# EAGLE schematic Fulmar_v_1_1_0 (EAGLE 8.3.2)

## Sheet 1 of 3
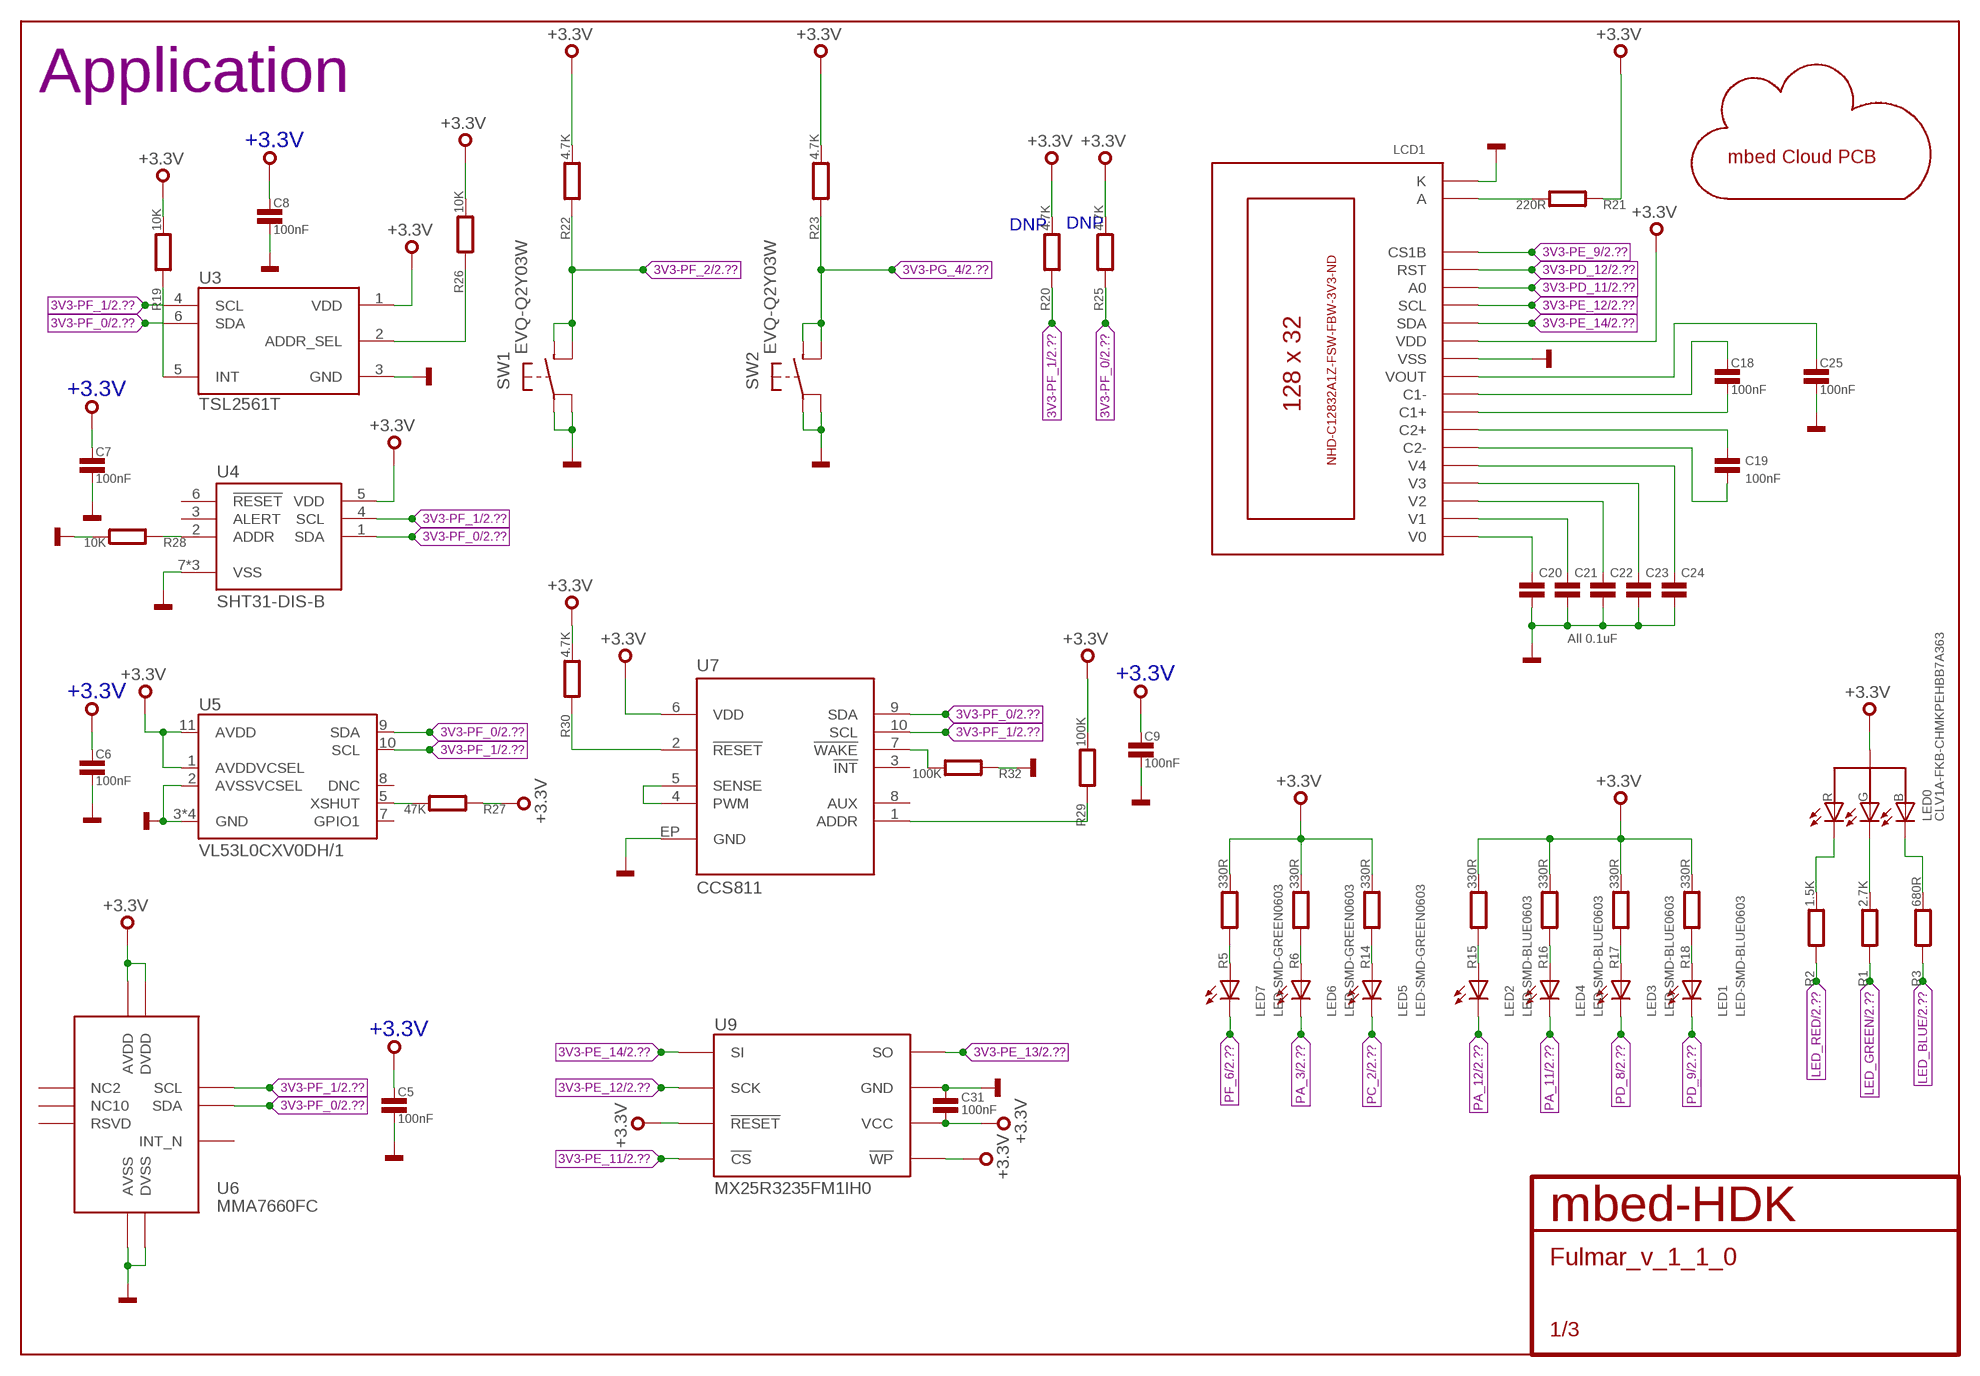
[diagram p0: schematic, sheet 1]

### Parts
C5  100nF  CAPACITOR0603  [0603]
C6  100nF  CAPACITOR0603  [0603]
C7  100nF  CAPACITOR0603  [0603]
C8  100nF  CAPACITOR0603  [0603]
C9  100nF  CAPACITOR0603  [0603]
C18  100nF  CAPACITOR0402  [0402]
C19  100nF  CAPACITOR0402  [0402]
C20  100nF  CAPACITOR0402  [0402]
C21  100nF  CAPACITOR0402  [0402]
C22  100nF  CAPACITOR0402  [0402]
C23  100nF  CAPACITOR0402  [0402]
C24  100nF  CAPACITOR0402  [0402]
C25  100nF  CAPACITOR0402  [0402]
C31  100nF  CAPACITOR0603  [0603]
LCD1  C12832A1Z  [C12832A1Z]
LED0  CLV1A-FKB-CHMKPEHBB7A363  [CLV1A-FKB-CHMKPEHBB7A363]
LED1  LED-SMD-BLUE0603  [CHIPLED_0603]
LED2  LED-SMD-BLUE0603  [CHIPLED_0603]
LED3  LED-SMD-BLUE0603  [CHIPLED_0603]
LED4  LED-SMD-BLUE0603  [CHIPLED_0603]
LED5  LED-SMD-GREEN0603  [CHIPLED_0603]
LED6  LED-SMD-GREEN0603  [CHIPLED_0603]
LED7  LED-SMD-GREEN0603  [CHIPLED_0603]
R1  2.7K  RESISTOR0402  [0402]
R2  1.5K  RESISTOR0402  [0402]
R3  680R  RESISTOR0402  [0402]
R5  330R  RESISTOR0402  [0402]
R6  330R  RESISTOR0402  [0402]
R14  330R  RESISTOR0402  [0402]
R15  330R  RESISTOR0402  [0402]
R16  330R  RESISTOR0402  [0402]
R17  330R  RESISTOR0402  [0402]
R18  330R  RESISTOR0402  [0402]
R19  10K  RESISTOR0402  [0402]
R20  4.7K  RESISTOR0402  [0402]
R21  220R  RESISTOR0402  [0402]
R22  4.7K  RESISTOR0402  [0402]
R23  4.7K  RESISTOR0402  [0402]
R25  4.7K  RESISTOR0402  [0402]
R26  10K  RESISTOR0402  [0402]
R27  47K  RESISTOR0402  [0402]
R28  10K  RESISTOR0402  [0402]
R29  100K  RESISTOR0402  [0402]
R30  4.7K  RESISTOR0402  [0402]
R32  100K  RESISTOR0402  [0402]
SW1  EVQ-Q2Y03W  [EVQ-Q2Y03W]
SW2  EVQ-Q2Y03W  [EVQ-Q2Y03W]
U3  TSL2561T  [6-TMB]
U4  SHT31-DIS-B  [8-DFN]
U5  VL53L0CXV0DH/1  [VL53L0CXV0DH/1]
U6  MMA7660FC  [DFN10-3X3MM]
U7  CCS811  [LGA10]
U9  MX25R3235FM1IH0  [SO8]
U$2  MBEDCLOUDPCB  [MBEDCLOUDPCB]

### Nets
3V3-PD_11: LCD1.P$15(A0) ; also sheet 2
3V3-PD_12: LCD1.P$16(RST) ; also sheet 2
3V3-PE_9: LCD1.P$17(CS1B) ; also sheet 2
3V3-PE_11: U9.1(!CS) ; also sheet 2
3V3-PE_12: LCD1.P$14(SCL) U9.6(SCK) ; also sheet 2
3V3-PE_13: U9.2(SO) ; also sheet 2
3V3-PE_14: LCD1.P$13(SDA) U9.5(SI) ; also sheet 2
3V3-PF_0: R25.1 U3.6(SDA) U4.1(SDA) U5.9(SDA) U6.P$7(SDA) U7.9(SDA) ; also sheet 2
3V3-PF_1: R20.1 U3.4(SCL) U4.4(SCL) U5.10(SCL) U6.P$6(SCL) U7.10(SCL) ; also sheet 2
3V3-PF_2: R22.1 SW1.P$3(B1) SW1.P$4(B2) ; also sheet 2
3V3-PG_4: R23.1 SW2.P$3(B1) SW2.P$4(B2) ; also sheet 2
+3.3V: C5.1 C6.1 C7.1 C8.1 C9.1 C31.2 LCD1.P$12(VDD) LED0.2 R5.2 R6.2 R14.2 R15.2 R16.2 R17.2 R18.2 R19.2 R20.2 R21.1 R22.2 R23.2 R25.2 R26.2 R27.1 R29.2 R30.2 U3.1(VDD) U4.5(VDD) U5.1(AVDDVCSEL) U5.11(AVDD) U6.P$3(AVDD) U6.P$9(DVDD) U7.6(VDD) U9.3(!WP) U9.7(!RESET) U9.8(VCC) ; also sheet 2,3
GND: C5.2 C6.2 C7.2 C8.2 C9.2 C20.2 C21.2 C22.2 C23.2 C24.2 C25.2 C31.1 LCD1.K LCD1.P$11(VSS) R28.2 R32.1 SW1.P$1(A1) SW1.P$2(A2) SW2.P$1(A1) SW2.P$2(A2) U3.3(GND) U4.7(VSS) U4.8(VSS) U4.9(VSS) U5.2(AVSSVCSEL) U5.3(GND) U5.4(GND) U5.6(GND) U5.12(GND) U6.P$4(AVSS) U6.P$8(DVSS) U7.EP(GND) U9.4(GND) ; also sheet 2,3
LED_BLUE: R3.1 ; also sheet 2
LED_GREEN: R1.1 ; also sheet 2
LED_RED: R2.1 ; also sheet 2
N$1: R27.2 U5.5(XSHUT)
N$2: R30.1 U7.2(!RESET!)
N$3: R28.1 U4.2(ADDR)
N$4: U7.4(PWM) U7.5(SENSE)
N$5: R29.1 U7.1(ADDR)
N$6: R32.2 U7.7(!WAKE!)
N$7: C18.1 LCD1.P$9(C1-)
N$8: C18.2 LCD1.P$8(C1+)
N$9: C19.1 LCD1.P$7(C2+)
N$10: C19.2 LCD1.P$6(C2-)
N$11: C20.1 LCD1.P$1(V0)
N$12: C21.1 LCD1.P$2(V1)
N$13: LCD1.A R21.2
N$14: C22.1 LCD1.P$3(V2)
N$15: C23.1 LCD1.P$4(V3)
N$16: C24.1 LCD1.P$5(V4)
N$17: LED0.1 R2.2
N$18: C25.1 LCD1.P$10(VOUT)
N$19: LED0.4 R1.2
N$20: LED0.3 R3.2
N$21: LED7.A R5.1
N$23: LED6.A R6.1
N$24: R19.1 U3.5(INT)
N$25: LED5.A R14.1
N$26: R26.1 U3.2(ADDR_SEL)
N$28: LED2.A R15.1
N$30: LED4.A R16.1
N$31: LED3.A R17.1
N$32: LED1.A R18.1
PA_3: LED6.C ; also sheet 2
PA_11: LED4.C ; also sheet 2
PA_12: LED2.C ; also sheet 2
PC_2: LED5.C ; also sheet 2
PD_8: LED3.C ; also sheet 2
PD_9: LED1.C ; also sheet 2
PF_6: LED7.C ; also sheet 2
Unconnected: U4.3(ALERT) U4.6(!RESET) U5.7(GPIO1) U5.8(DNC) U6.P$1(RSVD) U6.P$2(NC2) U6.P$5(INT_N) U6.P$10(NC10) U7.3(!INT!) U7.8(AUX)

### Notes on the sheet
- Application
- DNP | DNP
- All 0.1uF

## Sheet 2 of 3
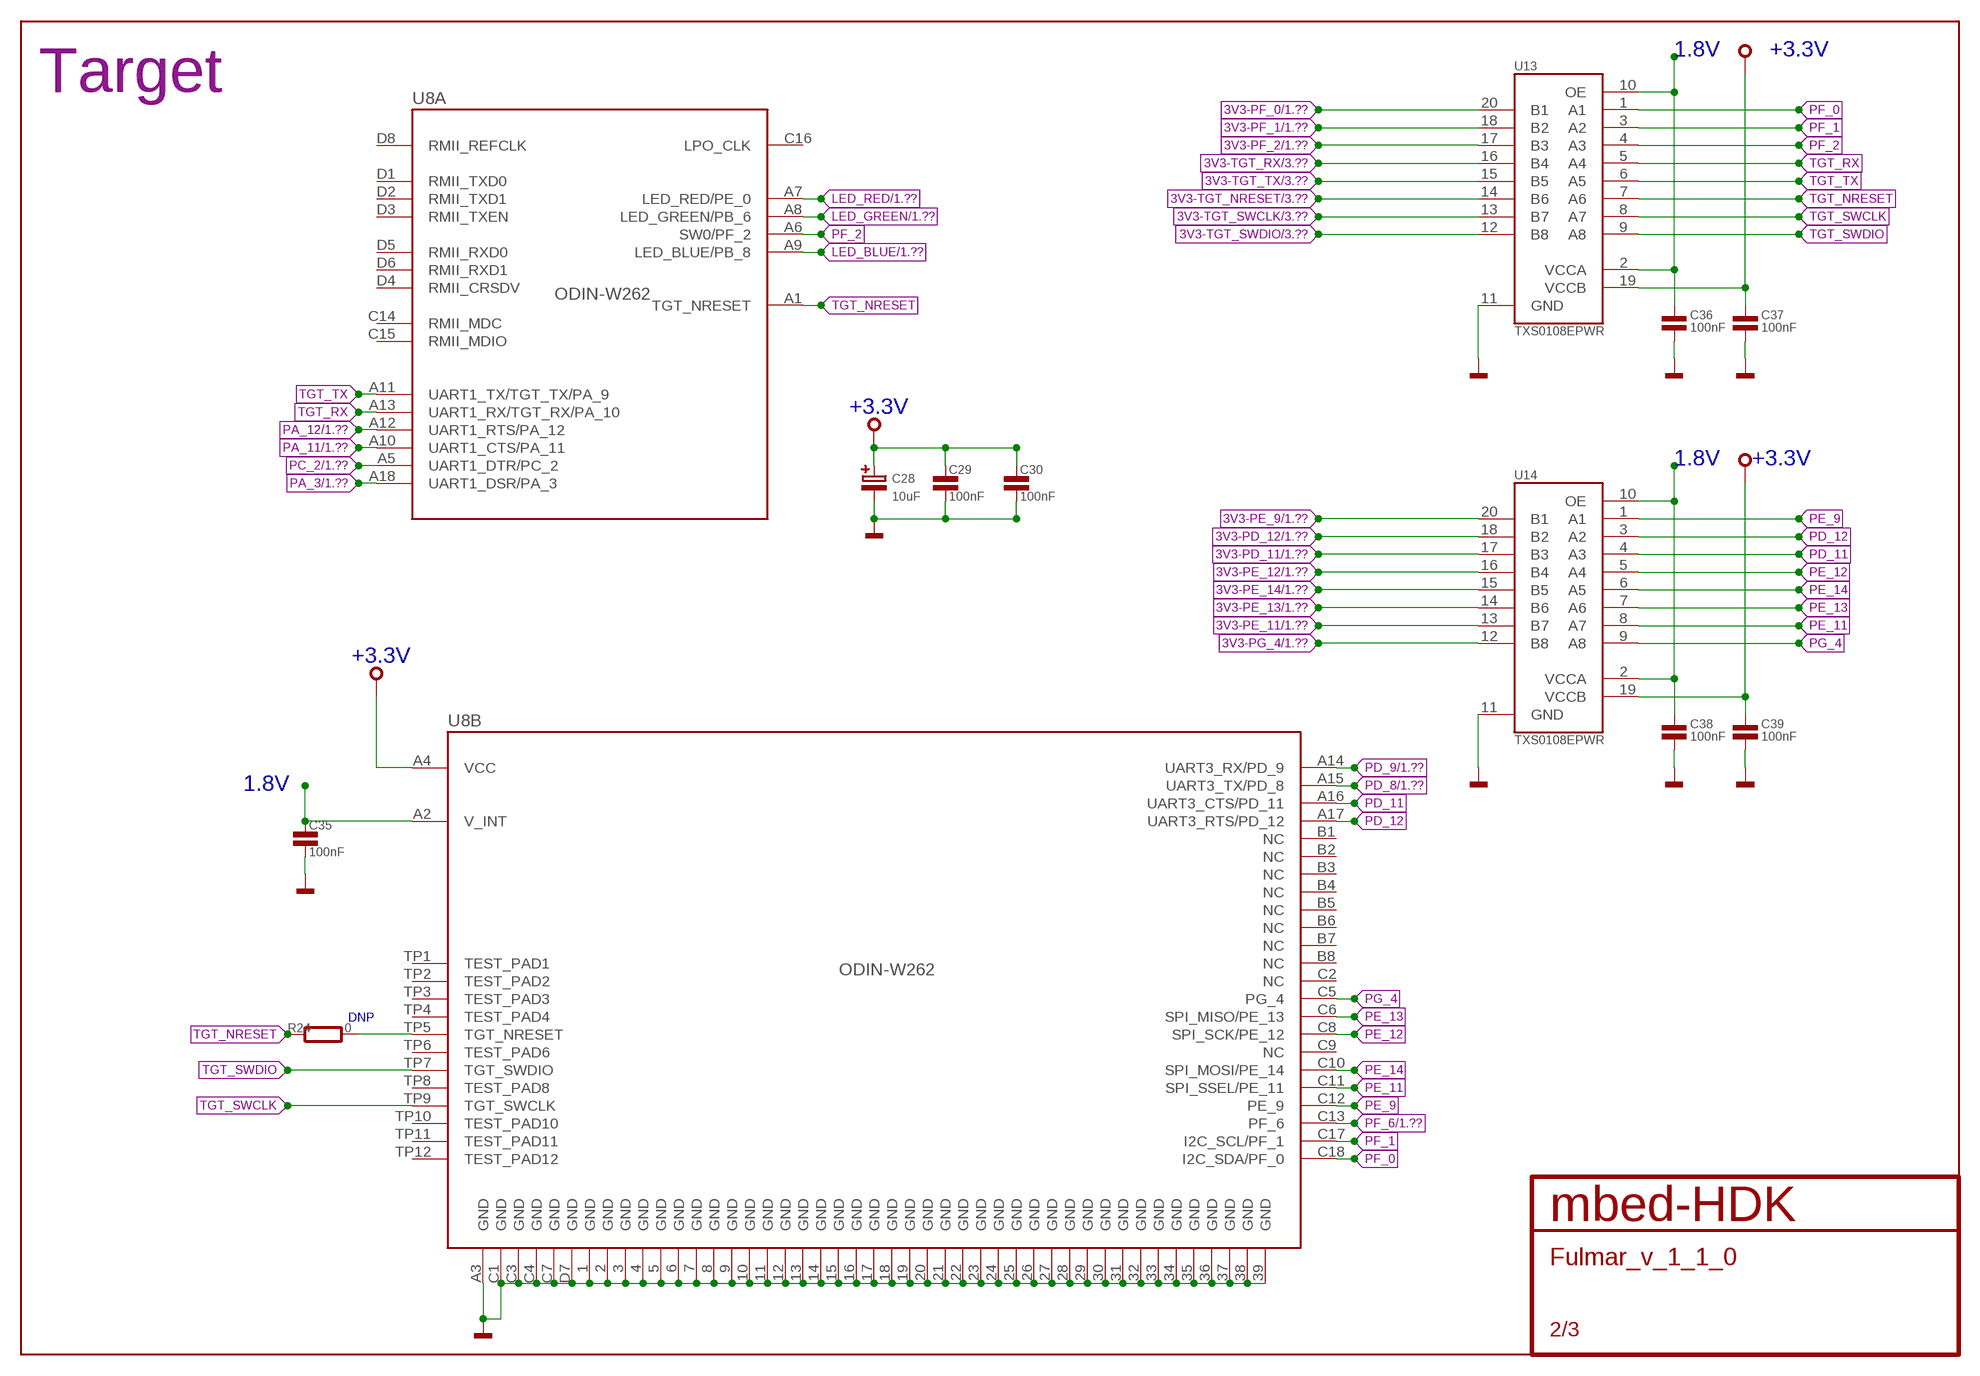
[diagram p1: schematic, sheet 2]

### Parts
C28  10uF  CAPACITOR-POLARISEDB  [SMC_B]
C29  100nF  CAPACITOR0603  [0603]
C30  100nF  CAPACITOR0603  [0603]
C35  100nF  CAPACITOR0603  [0603]
C36  100nF  CAPACITOR0603  [0603]
C37  100nF  CAPACITOR0603  [0603]
C38  100nF  CAPACITOR0603  [0603]
C39  100nF  CAPACITOR0603  [0603]
R24  0  RESISTOR0402  [0402]
U8  ODIN-W262  [ODIN-88]
U13  TXS0108EPWR  [TSSOP-20]
U14  TXS0108EPWR  [TSSOP-20]

### Nets
1.8V: C35.1 C36.1 C38.1 U8.A2(B:V_INT) U13.2(VCCA) U13.10(OE) U14.2(VCCA) U14.10(OE)
3V3-PD_11: U14.17(B3) ; also sheet 1
3V3-PD_12: U14.18(B2) ; also sheet 1
3V3-PE_9: U14.20(B1) ; also sheet 1
3V3-PE_11: U14.13(B7) ; also sheet 1
3V3-PE_12: U14.16(B4) ; also sheet 1
3V3-PE_13: U14.14(B6) ; also sheet 1
3V3-PE_14: U14.15(B5) ; also sheet 1
3V3-PF_0: U13.20(B1) ; also sheet 1
3V3-PF_1: U13.18(B2) ; also sheet 1
3V3-PF_2: U13.17(B3) ; also sheet 1
3V3-PG_4: U14.12(B8) ; also sheet 1
3V3-TGT_NRESET: U13.14(B6) ; also sheet 3
3V3-TGT_RX: U13.16(B4) ; also sheet 3
3V3-TGT_SWCLK: U13.13(B7) ; also sheet 3
3V3-TGT_SWDIO: U13.12(B8) ; also sheet 3
3V3-TGT_TX: U13.15(B5) ; also sheet 3
+3.3V: C28.+ C29.1 C30.1 C37.1 C39.1 U8.A4(B:VCC) U13.19(VCCB) U14.19(VCCB) ; also sheet 1,3
GND: C28.- C29.2 C30.2 C35.2 C36.2 C37.2 C38.2 C39.2 U8.1(B:GND) U8.2(B:GND) U8.3(B:GND) U8.4(B:GND) U8.5(B:GND) U8.6(B:GND) U8.7(B:GND) U8.8(B:GND) U8.9(B:GND) U8.10(B:GND) U8.11(B:GND) U8.12(B:GND) U8.13(B:GND) U8.14(B:GND) U8.15(B:GND) U8.16(B:GND) U8.17(B:GND) U8.18(B:GND) U8.19(B:GND) U8.20(B:GND) U8.21(B:GND) U8.22(B:GND) U8.23(B:GND) U8.24(B:GND) U8.25(B:GND) U8.26(B:GND) U8.27(B:GND) U8.28(B:GND) U8.29(B:GND) U8.30(B:GND) U8.31(B:GND) U8.32(B:GND) U8.33(B:GND) U8.34(B:GND) U8.35(B:GND) U8.36(B:GND) U8.37(B:GND) U8.38(B:GND) U8.39(B:GND) U8.A3(B:GND) U8.C1(B:GND) U8.C3(B:GND) U8.C4(B:GND) U8.C7(B:GND) U8.D7(B:GND) U13.11(GND) U14.11(GND) ; also sheet 1,3
LED_BLUE: U8.A9(A:LED_BLUE/PB_8) ; also sheet 1
LED_GREEN: U8.A8(A:LED_GREEN/PB_6) ; also sheet 1
LED_RED: U8.A7(A:LED_RED/PE_0) ; also sheet 1
N$22: R24.2 U8.TP5(B:TGT_NRESET)
PA_3: U8.A18(A:UART1_DSR/PA_3) ; also sheet 1
PA_11: U8.A10(A:UART1_CTS/PA_11) ; also sheet 1
PA_12: U8.A12(A:UART1_RTS/PA_12) ; also sheet 1
PC_2: U8.A5(A:UART1_DTR/PC_2) ; also sheet 1
PD_8: U8.A15(B:UART3_TX/PD_8) ; also sheet 1
PD_9: U8.A14(B:UART3_RX/PD_9) ; also sheet 1
PD_11: U8.A16(B:UART3_CTS/PD_11) U14.4(A3)
PD_12: U8.A17(B:UART3_RTS/PD_12) U14.3(A2)
PE_9: U8.C12(B:PE_9) U14.1(A1)
PE_11: U8.C11(B:SPI_SSEL/PE_11) U14.8(A7)
PE_12: U8.C8(B:SPI_SCK/PE_12) U14.5(A4)
PE_13: U8.C6(B:SPI_MISO/PE_13) U14.7(A6)
PE_14: U8.C10(B:SPI_MOSI/PE_14) U14.6(A5)
PF_0: U8.C18(B:I2C_SDA/PF_0) U13.1(A1)
PF_1: U8.C17(B:I2C_SCL/PF_1) U13.3(A2)
PF_2: U8.A6(A:SW0/PF_2) U13.4(A3)
PF_6: U8.C13(B:PF_6) ; also sheet 1
PG_4: U8.C5(B:PG_4) U14.9(A8)
TGT_NRESET: R24.1 U8.A1(A:TGT_NRESET) U13.7(A6)
TGT_RX: U8.A13(A:UART1_RX/TGT_RX/PA_10) U13.5(A4)
TGT_SWCLK: U8.TP9(B:TGT_SWCLK) U13.8(A7)
TGT_SWDIO: U8.TP7(B:TGT_SWDIO) U13.9(A8)
TGT_TX: U8.A11(A:UART1_TX/TGT_TX/PA_9) U13.6(A5)
Unconnected: U8.B1(B:NC) U8.B2(B:NC) U8.B3(B:NC) U8.B4(B:NC) U8.B5(B:NC) U8.B6(B:NC) U8.B7(B:NC) U8.B8(B:NC) U8.C2(B:NC) U8.C9(B:NC) U8.C14(A:RMII_MDC) U8.C15(A:RMII_MDIO) U8.C16(A:LPO_CLK) U8.D1(A:RMII_TXD0) U8.D2(A:RMII_TXD1) U8.D3(A:RMII_TXEN) U8.D4(A:RMII_CRSDV) U8.D5(A:RMII_RXD0) U8.D6(A:RMII_RXD1) U8.D8(A:RMII_REFCLK) U8.TP1(B:TEST_PAD1) U8.TP2(B:TEST_PAD2) U8.TP3(B:TEST_PAD3) U8.TP4(B:TEST_PAD4) U8.TP6(B:TEST_PAD6) U8.TP8(B:TEST_PAD8) U8.TP10(B:TEST_PAD10) U8.TP11(B:TEST_PAD11) U8.TP12(B:TEST_PAD12)

### Notes on the sheet
- Target
- DNP

## Sheet 3 of 3
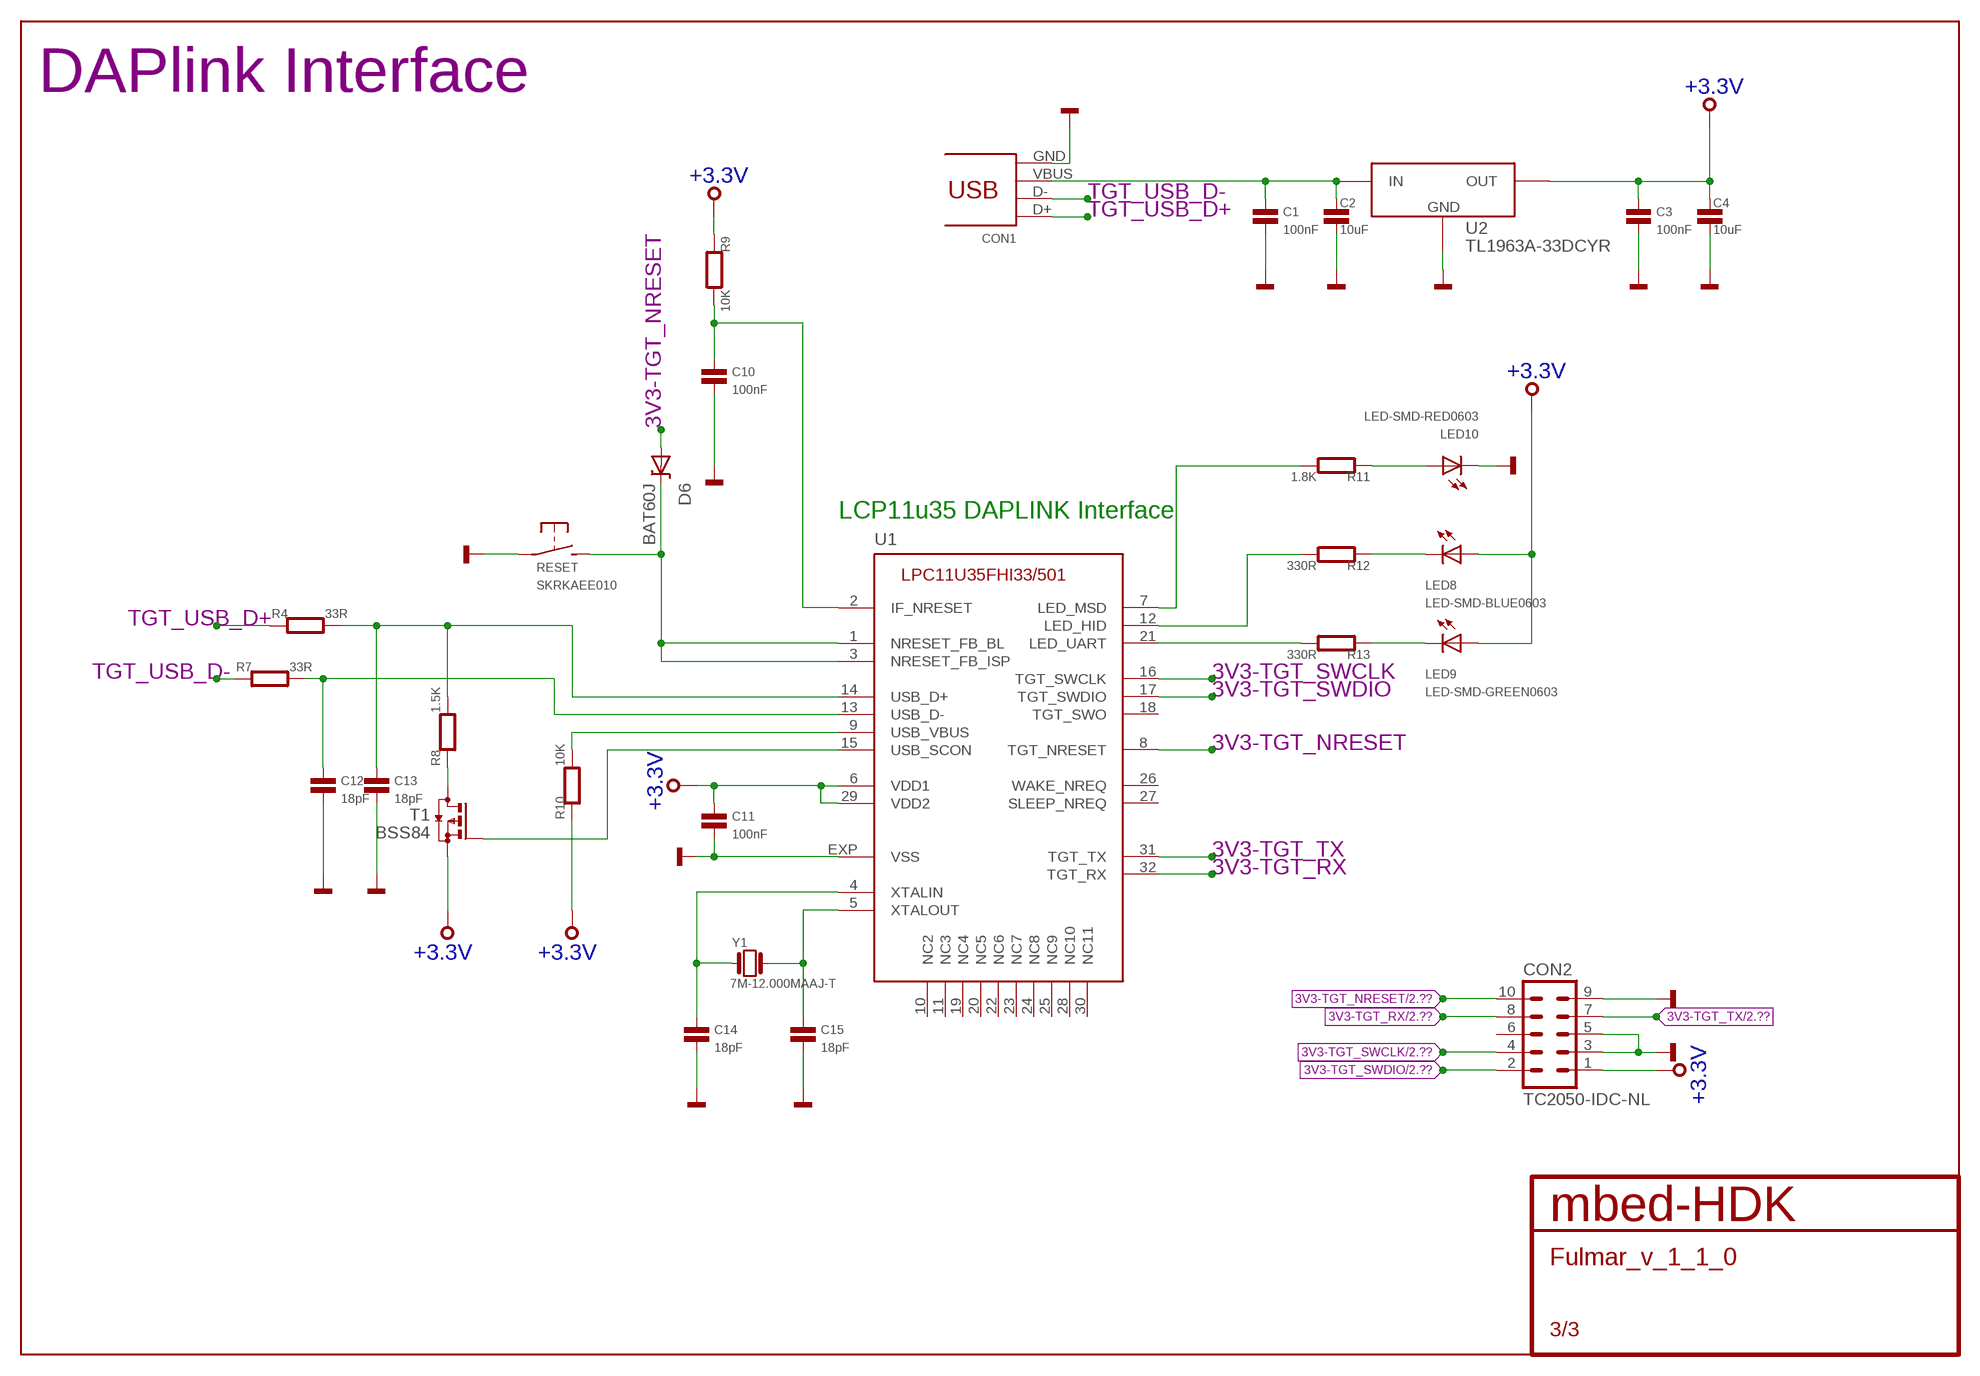
[diagram p2: schematic, sheet 3]

### Parts
C1  100nF  CAPACITOR0402  [0402]
C2  10uF  CAPACITOR0603  [0603]
C3  100nF  CAPACITOR0402  [0402]
C4  10uF  CAPACITOR0603  [0603]
C10  100nF  CAPACITOR0402  [0402]
C11  100nF  CAPACITOR0402  [0402]
C12  18pF  CAPACITOR0402  [0402]
C13  18pF  CAPACITOR0402  [0402]
C14  18pF  CAPACITOR0402  [0402]
C15  18pF  CAPACITOR0402  [0402]
CON1  47346-0001  [USB-MICRO-B-H]
CON2  TC2050-IDC-NL  [TC2050-IDC-NL]
D6  BAT60J  [SOD323]
LED8  LED-SMD-BLUE0603  [CHIPLED_0603]
LED9  LED-SMD-GREEN0603  [CHIPLED_0603]
LED10  LED-SMD-RED0603  [CHIPLED_0603]
R4  33R  RESISTOR0402  [0402]
R7  33R  RESISTOR0402  [0402]
R8  1.5K  RESISTOR0402  [0402]
R9  10K  RESISTOR0402  [0402]
R10  10K  RESISTOR0402  [0402]
R11  1.8K  RESISTOR0402  [0402]
R12  330R  RESISTOR0402  [0402]
R13  330R  RESISTOR0402  [0402]
RESET  SKRKAEE010  [SKRKAEE010]
T1  BSS84  [SOT23-3]
U1  IF_LPC11U35FHI33/501  [HVQFN33]
U2  TL1963A-33DCYR  [SOT223]
Y1  7M-12.000MAAJ-T  [3.2X.2.5]

### Nets
3V3-TGT_NRESET: CON2.10 D6.A U1.8(TGT_NRESET) ; also sheet 2
3V3-TGT_RX: CON2.8 U1.32(TGT_RX) ; also sheet 2
3V3-TGT_SWCLK: CON2.4 U1.16(TGT_SWCLK) ; also sheet 2
3V3-TGT_SWDIO: CON2.2 U1.17(TGT_SWDIO) ; also sheet 2
3V3-TGT_TX: CON2.7 U1.31(TGT_TX) ; also sheet 2
+3.3V: C3.1 C4.1 C11.1 CON2.1 LED8.A LED9.A R9.1 R10.1 T1.2(S) U1.6(VDD1) U1.29(VDD2) U2.3(OUT) ; also sheet 1,2
GND: C1.2 C2.2 C3.2 C4.2 C10.2 C11.2 C12.2 C13.2 C14.2 C15.2 CON1.GND CON2.3 CON2.5 CON2.9 LED10.C RESET.P$1(P) U1.EXP(VSS) U2.2(GND) U2.4(GND) ; also sheet 1,2
HID1: R12.2 U1.12(LED_HID)
IF_NRESET1: C10.1 R9.2 U1.2(IF_NRESET)
ISP1: D6.K RESET.P$2(S) U1.1(NRESET_FB_BL) U1.3(NRESET_FB_ISP)
MSD1: R11.2 U1.7(LED_MSD)
N$50: C13.1 R4.2 R8.2 U1.14(USB_D+)
N$51: C12.1 R7.2 U1.13(USB_D-)
N$52: T1.1(G) U1.15(USB_SCON)
N$53: R8.1 T1.3(D)
N$54: R10.2 U1.9(USB_VBUS)
N$55: LED8.C R12.1
N$56: LED9.C R13.1
N$57: C15.1 U1.5(XTALOUT) Y1.P$3
N$58: C14.1 U1.4(XTALIN) Y1.P$1
N$59: C1.1 C2.1 CON1.VBUS U2.1(IN)
N$60: LED10.A R11.1
TGT_USB_D+: CON1.D+ R4.1
TGT_USB_D-: CON1.D- R7.1
UART1: R13.2 U1.21(LED_UART)
Unconnected: CON2.6 U1.10(NC2) U1.11(NC3) U1.18(TGT_SWO) U1.19(NC4) U1.20(NC5) U1.22(NC6) U1.23(NC7) U1.24(NC8) U1.25(NC9) U1.26(WAKE_NREQ) U1.27(SLEEP_NREQ) U1.28(NC10) U1.30(NC11)

### Notes on the sheet
- DAPlink Interface
- LCP11u35 DAPLINK Interface

## Library data of the parts
C1 C3 C10-C15 = mbed-HDK-RLCQ:CAPACITOR: Capacitor
C2 C4-C9 C18-C25 C29-C31 C35-C39 = mbed-HDK-RLC:CAPACITOR: Capacitor
C28 = mbed-HDK-RLC:CAPACITOR-POLARISED: Polarised capacitor; MF: Kemet; MFN: T491B106K020AT; OC-DIGIKEY: 399-8298-1-ND; OC-MOUSER: 80-T491B106K020; OC-NEWARK: 57K1740
CON1 = mbed-HDK-Connector:47346-0001: USB Receptacle Horizontal Micro Type B; MF: MOLEX; MFN: 47346-0001; OC-DIGIKEY: WM17141CT-ND; OC-MOUSER: 538-47346-0001; OC-NEWARK: 1568026
CON2 = mbed-HDK-Connector:TC2050-IDC: Tag-Connect In Circuit Programming & Debug Cable 10 Pin
D6 = mbed-HDK-Transistor:BAT60J: SCHOTTKY DIODE; MF: STMicroelectronics; MFN: BAT60JFILM; OC-DIGIKEY: 497-3707-6-ND; OC-MOUSER: 511-BAT60JFILM; OC-NEWARK: 89K1218
LCD1 = mbed-HDK-Optical:C12832A1Z
LED0 = mbed-HDK-Optical:CLV1A-FKB-CHMKPEHBB7A363: LED RGB SMD; MF: Cree; MFN: CLV1A-FKB-CHMKPEHBB7A363; OC-DIGIKEY: CLV1A-FKB-CHMKPEHBB7A363CT-ND; OC-MOUSER: 941-V1AFKBCHMKPEH7A3; OC-NEWARK: 2430039
LED1-LED4 LED8 = mbed-HDK-Optical:LED-SMD-BLUE: LED SMD, Colour Blue; MF: Wurth Electronics Inc; MFN: 150060BS75000; OC-DIGIKEY: 732-4966-1-ND; OC-MOUSER: 732-4966-1-ND; OC-NEWARK: 2322069
LED5-LED7 LED9 = mbed-HDK-Optical:LED-SMD-GREEN: LED SMD, Colour Green; MF: Wurth Electronics Inc; MFN: 150060GS75000; OC-DIGIKEY: 732-4971-1-ND; OC-MOUSER: 732-4971-1-ND; OC-NEWARK: 2322070
LED10 = mbed-HDK-Optical:LED-SMD-RED: LED SMD, Colour Red; MF: Wurth Electronics Inc; MFN: 150060RS75000; OC-DIGIKEY: 732-4978-1-ND; OC-MOUSER: 710-150060RS75000; OC-NEWARK: 2322071
R1-R3 R5 R6 R14-R30 R32 = mbed-HDK-RLC:RESISTOR: Resistor
R4 R7-R13 = mbed-HDK-RLCQ:RESISTOR: Resistor
RESET = mbed-HDK-Switch:SKRKAEE010: MOMENTARY SWITCH PUSH VERTICAL (SPST); MF: ALPS; MFN: SKRKAEE010; OC-MOUSER: 688-SKRKAE
SW1 SW2 = mbed-HDK-Switch:EVQ-Q2Y03W: MOMENTARY SWITCH PUSH VERTICAL (4-SPST); MF: Panasonic; MFN: EVQ-Q2Y03W; OC-DIGIKEY: P12961SCT-ND
T1 = mbed-HDK-Transistor:BSS84: MOSFET P-CHANNEL; MF: Fairchild Semiconductor; MFN: BSS84; OC-DIGIKEY: BSS84CT-ND; OC-MOUSER: 512-BSS84; OC-NEWARK: 58K8770
U1 = mbed-HDK-MF-NXP:IF_LPC11U35FHI33/501: CMSIS-DAP Interface : 32-bit LPC11U00 ARM Cortex M3 RISC 64KB Flash 2.5V/3.3V 33-Pin HVQFN EP; MF: NXP; MFN: LPC11U35FHI33/501; OC-DIGIKEY: 568-9586-ND; OC-MOUSER: 771-LPC11U35FHI33501; OC-NEWARK: 2115658
U2 = mbed-HDK-Power:TL1963A-33DCYR: LDO Fixed Regulator 3.3v, 1.5A; MF: Texas Instruments; MFN: TL1963A-33DCYR; OC-DIGIKEY: 296-24897-1-ND; OC-MOUSER: 595-TL1963A-33DCYR; OC-NEWARK: 94T5083
U3 = mbed-HDK-IC:TSL2561T: Sensor Light Digital, 6-TMB; MF: ams; MFN: TSL2561T; OC-DIGIKEY: TSL2561-TCT-ND; OC-NEWARK: 05M1632
U4 = mbed-HDK-IC:SHT31-DIS-B: Temperature and Humidity Sensor I2C 2% 8DFN; MF: Sensirion; MFN: SHT31-DIS-B; OC-DIGIKEY: 1649-1011-1-ND; OC-MOUSER: 403-SHT31-DIS-B; OC-NEWARK: 2474218
U5 = mbed-HDK-IC:VL53L0CXV0DH/1: Time-of-Flight (ToF) ranging sensor 0-1200/2000mm; MF: ST Microelectronics; MFN: VL53L0CXV0DH/1; OC-DIGIKEY: 497-16538-1-ND; OC-MOUSER: 511-VL53L0CXV0DH/1; OC-NEWARK: 79Y6076
U6 = mbed-HDK-IC:MMA7660FC: ACCELEROMETER 1.5G I2C 10DFN; MF: NXP; MFN: MMA7660FCT; OC-DIGIKEY: MMA7660FCT-ND; OC-FARNELL: 2238133; OC-MOUSER: 841-MMA7660FCT
U7 = mbed-HDK-IC:CCS811: Air Quality Sensors Ultra-Low Power Digital Gas Sensor I2C; MF: ams; MFN: CCS811; OC-DIGIKEY: CCS811CT-ND; OC-NEWARK: 06AC5965
U8 = mbed-HDK-MF-UBLOX:ODIN-W262: ODIN-W260: Host-based multiradio module with Wi-Fi and Bluetooth, internal antenna u-blox.com
U9 = mbed-HDK-IC:MX25R3235FM1IH0: Serial Flash 32 Mb 80 Mhz; MF: Macronix; MFN: MX25R3235FM1IH0; OC-DIGIKEY: 1092-1175-ND
U13 U14 = mbed-HDK-IC:TXS0108EPWR: 8-Bit Bi-directional, Level-Shifting, Voltage Translator; MF: Texas Instruments; MFN: TXS0108EPWR; OC-DIGIKEY: 296-23011-1-ND; OC-MOUSER: 595-TXS0108EPWR; OC-NEWARK: 05R8300
U$2 = Treadstone:MBEDCLOUDPCB
Y1 = mbed-HDK-Oscillator:7M-12.000MAAJ-T: Crystal, TXC 12MHz ±30ppm 18pF; MF: TXC; MFN: 7M-12.000MAAJ-T; OC-DIGIKEY: 887-1121-1-ND; OC-MOUSER: 717-7M-12.000MAAJ-T; OC-NEWARK: 84R5706